# Altium schematic sheet OUT_PIN.SchDoc
size A4; SheetNumber: 6; SheetTotal: 6
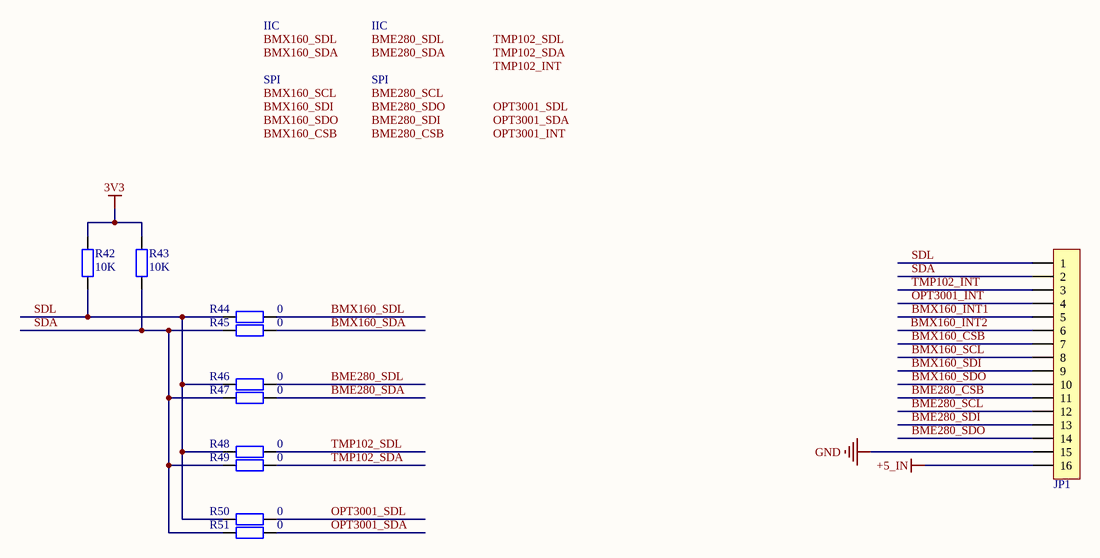
[diagram p0: OUT_PIN.SchDoc]

## Parts
JP1  HDR-1X16  [HDR2.54-LI-16P]  (value not drawn)
R42  10K  [R 0402_L]
R43  10K  [R 0402_L]
R44  0  [R 0402_L]
R45  0  [R 0402_L]
R46  0  [R 0402_L]
R47  0  [R 0402_L]
R48  0  [R 0402_L]
R49  0  [R 0402_L]
R50  0  [R 0402_L]
R51  0  [R 0402_L]

## Nets
3V3: R42.1 R43.1
+5_IN: JP1.16
GND: JP1.15
BME280_CSB: JP1.11
BME280_SCL: JP1.12
BME280_SDA: R47.1
BME280_SDI: JP1.13
BME280_SDL: R46.1
BME280_SDO: JP1.14
BMX160_CSB: JP1.7
BMX160_INT1: JP1.5
BMX160_INT2: JP1.6
BMX160_SCL: JP1.8
BMX160_SDA: R45.1
BMX160_SDI: JP1.9
BMX160_SDL: R44.1
BMX160_SDO: JP1.10
OPT3001_INT: JP1.4
OPT3001_SDA: R51.1
OPT3001_SDL: R50.1
SDA: JP1.2 R43.2 R45.2 R47.2 R49.2 R51.2
SDL: JP1.1 R42.2 R44.2 R46.2 R48.2 R50.2
TMP102_INT: JP1.3
TMP102_SDA: R49.1
TMP102_SDL: R48.1

## Notes on the sheet
- IIC
- SPI
- Labels drawn without touching a wire or pin: BME280_CSB, BME280_SCL, BME280_SDA, BME280_SDI, BME280_SDL, BME280_SDO, BMX160_CSB, BMX160_SCL, BMX160_SDA, BMX160_SDI, BMX160_SDL, BMX160_SDO, OPT3001_INT, OPT3001_SDA, OPT3001_SDL, TMP102_INT, TMP102_SDA, TMP102_SDL

## Library data of the parts
JP1 = Header 16: 16P接插件; 版权归属: 源创客; BOM名称: 16P接插件; 学习资源: www.ooocke.com
R42 R43 = R: 贴片电阻 0402 1%; 主类型: 电阻; 元件封装: 0402; 封装类型: 贴片; 温度漂移: ±100ppm/℃; 生产商: 国巨; 生产商零件编码: RC0402FR-0710KL; 值/型号: 10K; 值精度: ±1%; 具体类型: 贴片电阻; 立创编号: C60490
R44-R51 = R: 贴片电阻; 主类型: 电阻; 生产商: YAGEO（国巨）; 生产商零件编码: RC0402JR-070RL; 值/型号: 0; 立创编号: C60485